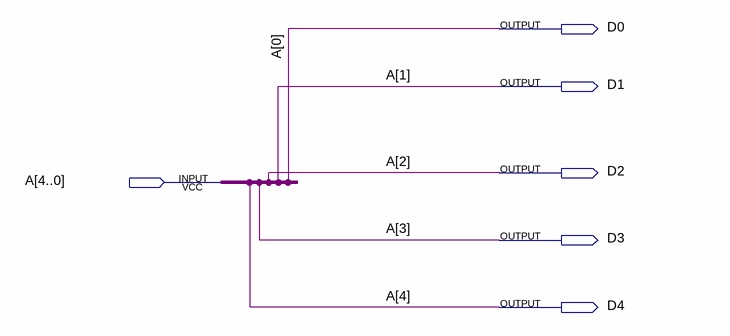
[diagram p0: schematic sheet]
// Quartus schematic adapter_5b_bus_to_5pin.bdf as structural Verilog: 0 symbols, 6 pins
module adapter_5b_bus_to_5pin (
  input  [4:0] A,
  output D0,
  output D1,
  output D2,
  output D3,
  output D4
);


  assign D0 = A[0];
  assign D1 = A[1];
  assign D2 = A[2];
  assign D3 = A[3];
  assign D4 = A[4];
endmodule
